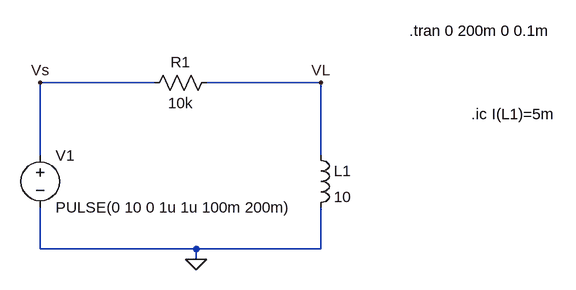
[diagram p0: schematic Circuit#3.asc]
Circuit#3.asc, the LTspice schematic file:
Version 4
SHEET 1 880 680
WIRE 224 32 48 32
WIRE 480 32 304 32
WIRE 48 144 48 32
WIRE 480 144 480 32
WIRE 48 288 48 224
WIRE 288 288 48 288
WIRE 480 288 480 224
WIRE 480 288 288 288
WIRE 288 304 288 288
FLAG 288 304 0
FLAG 48 32 Vs
FLAG 480 32 VL
SYMBOL voltage 48 128 R0
WINDOW 123 0 0 Left 0
WINDOW 39 0 0 Left 0
SYMATTR InstName V1
SYMATTR Value PULSE(0 10 0 1u 1u 100m 200m)
SYMBOL res 320 16 R90
WINDOW 0 0 56 VBottom 2
WINDOW 3 32 56 VTop 2
SYMATTR InstName R1
SYMATTR Value 10k
SYMBOL ind 464 128 R0
SYMATTR InstName L1
SYMATTR Value 10
TEXT 616 -48 Left 2 !.tran 0 200m 0 0.1m
TEXT 712 80 Left 2 !.ic I(L1)=5m

The netlist it stands for:
* Circuit#3.asc
V1 Vs 0 PULSE(0 10 0 1u 1u 100m 200m)
R1 VL Vs 10k
L1 VL 0 10
.tran 0 200m 0 0.1m
.ic I(L1)=5m
.backanno
.end